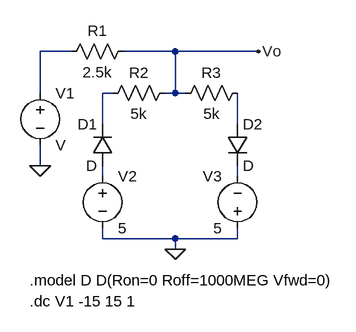
[diagram p0: schematic pag15es3.asc]
pag15es3.asc, the LTspice schematic file:
Version 4
SHEET 1 880 680
WIRE 96 64 48 64
WIRE 256 64 176 64
WIRE 384 64 256 64
WIRE 48 128 48 64
WIRE 160 128 144 128
WIRE 256 128 256 64
WIRE 256 128 240 128
WIRE 272 128 256 128
WIRE 144 176 144 128
WIRE 352 176 352 128
WIRE 48 240 48 208
WIRE 144 256 144 240
WIRE 352 256 352 240
WIRE 144 352 144 336
WIRE 256 352 144 352
WIRE 352 352 352 336
WIRE 352 352 256 352
WIRE 256 368 256 352
FLAG 48 240 0
FLAG 256 368 0
FLAG 384 64 Vo
SYMBOL voltage 48 112 R0
SYMATTR InstName V1
SYMBOL res 80 80 R270
WINDOW 0 32 56 VTop 2
WINDOW 3 0 56 VBottom 2
SYMATTR InstName R1
SYMATTR Value 2.5k
SYMBOL res 256 112 R90
WINDOW 0 0 56 VBottom 2
WINDOW 3 32 56 VTop 2
SYMATTR InstName R2
SYMATTR Value 5k
SYMBOL res 256 144 R270
WINDOW 0 32 56 VTop 2
WINDOW 3 0 56 VBottom 2
SYMATTR InstName R3
SYMATTR Value 5k
SYMBOL diode 160 240 R180
WINDOW 0 24 64 Left 2
WINDOW 3 24 0 Left 2
SYMATTR InstName D1
SYMBOL diode 336 176 R0
SYMATTR InstName D2
SYMBOL voltage 144 240 R0
SYMATTR InstName V2
SYMATTR Value 5
SYMBOL voltage 352 352 R180
WINDOW 0 24 96 Left 2
WINDOW 3 24 16 Left 2
SYMATTR InstName V3
SYMATTR Value 5
TEXT 32 416 Left 2 !.model D D(Ron=0 Roff=1000MEG Vfwd=0)
TEXT 32 448 Left 2 !.dc V1 -15 15 1

The netlist it stands for:
* pag15es3.asc
V1 N001 0 V
R1 N001 Vo 2.5k
R2 Vo N002 5k
R3 Vo N003 5k
D1 N004 N002 D
D2 N003 N005 D
V2 N004 0 5
V3 0 N005 5
.model D D
.lib standard.dio
.model D D(Ron=0 Roff=1000MEG Vfwd=0)
.dc V1 -15 15 1
.backanno
.end

* Results of the author's LTspice run, read from the files saved beside the schematic
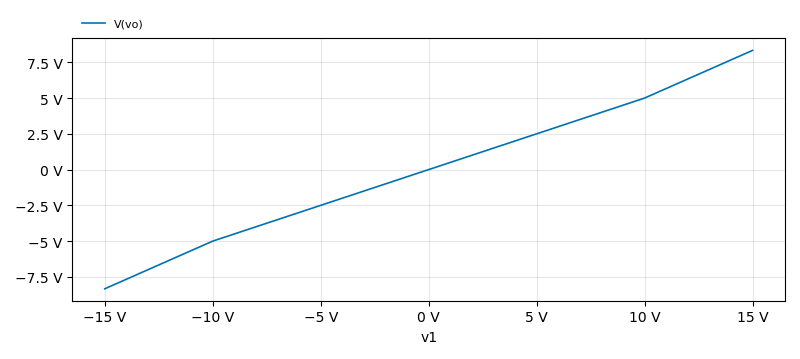
[diagram p1: DC transfer characteristic of pag15es3.asc, plotted from the saved traces]
* DC transfer characteristic, 1 run:
*   V(vo): -8.333 V at v1=-15 V, 8.333 V at v1=15 V, min -8.333 V, max 8.333 V